# EAGLE design KW_LCD (EAGLE 7.7.0)
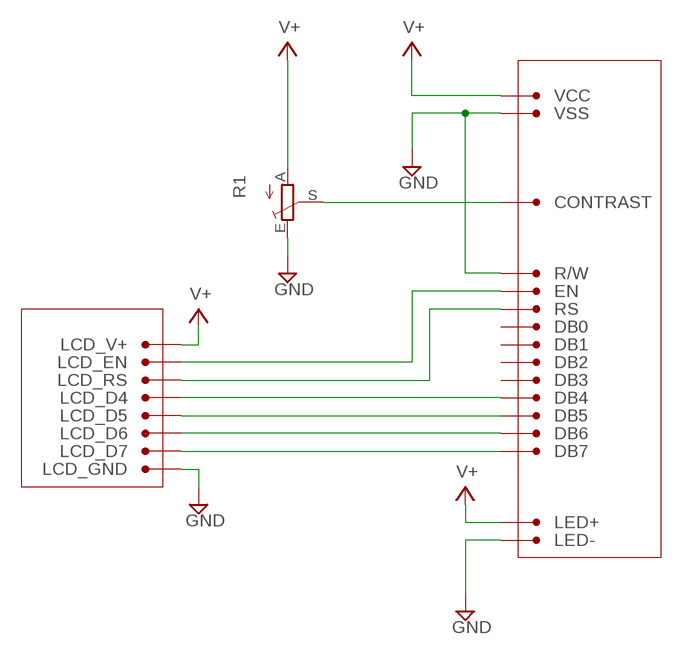
[diagram p0: schematic, sheet 1]

## Parts
CONTRAST  3  CONN  [CONN]
DB0  7  CONN  [CONN]
DB1  8  CONN  [CONN]
DB2  9  CONN  [CONN]
DB3  10  CONN  [CONN]
DB4  11  CONN  [CONN]
DB5  12  CONN  [CONN]
DB6  13  CONN  [CONN]
DB7  14  CONN  [CONN]
EN  6  CONN  [CONN]
LCD_D4  14  CONN  [CONN]
LCD_D5  14  CONN  [CONN]
LCD_D6  14  CONN  [CONN]
LCD_D7  14  CONN  [CONN]
LCD_EN  14  CONN  [CONN]
LCD_GND  14  CONN  [CONN]
LCD_RS  14  CONN  [CONN]
LCD_V+  14  CONN  [CONN]
LED+  16  CONN  [CONN]
LED-  15  CONN  [CONN]
R1  TRIM_EU-ECP10S  [ECP10S]
R/W  5  CONN  [CONN]
RS  4  CONN  [CONN]
VCC  2  CONN  [CONN]
VSS  1  CONN  [CONN]

## Nets
GND: LCD_GND.P$1 LED-.P$1 R1.E R/W.P$1 VSS.P$1
N$1: DB7.P$1 LCD_D7.P$1
N$2: DB6.P$1 LCD_D6.P$1
N$4: LCD_RS.P$1 RS.P$1
N$5: CONTRAST.P$1 R1.S
N$6: EN.P$1 LCD_EN.P$1
N$7: DB5.P$1 LCD_D5.P$1
N$8: DB4.P$1 LCD_D4.P$1
V+: LCD_V+.P$1 LED+.P$1 R1.A VCC.P$1
Unconnected: DB0.P$1 DB1.P$1 DB2.P$1 DB3.P$1

## Library data of the parts
CONTRAST DB0 DB1-DB7 EN LCD_D4-LCD_D7 LCD_EN LCD_GND LCD_RS LCD_V+ LED+ LED- R/W RS VCC VSS = Pin:CONN
R1 = pot:TRIM_EU-: POTENTIOMETER

## Board
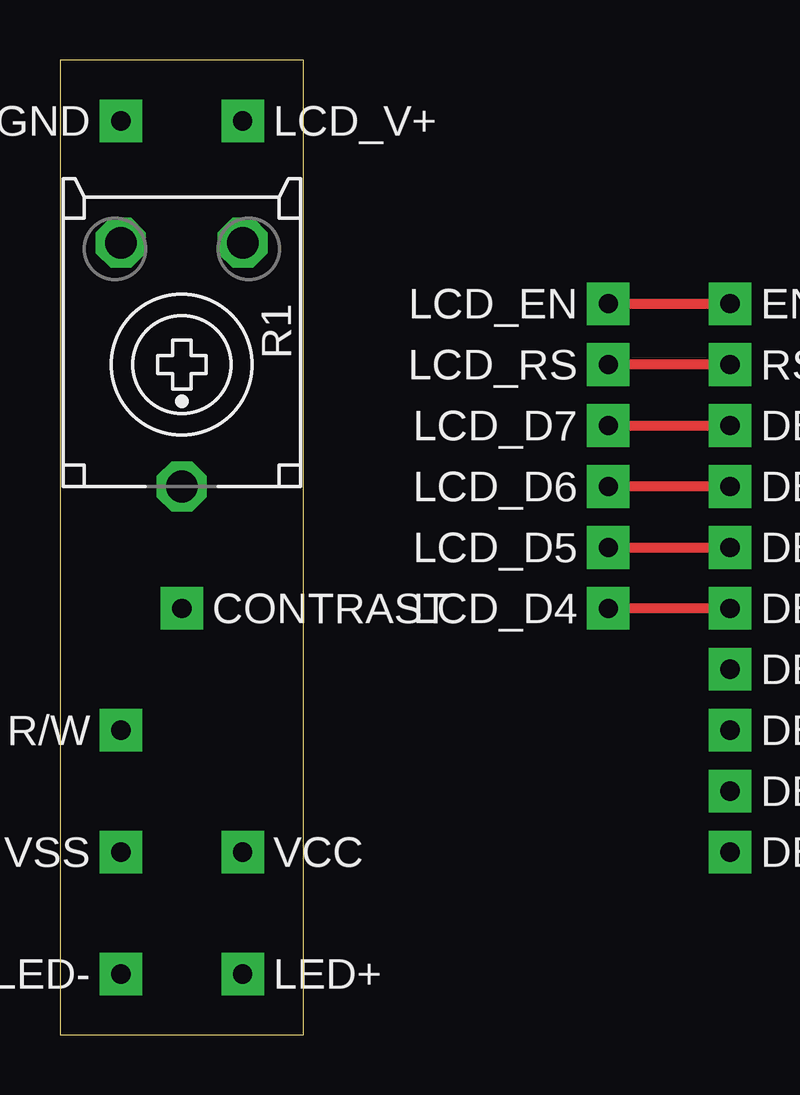
[diagram p1: board, top side]
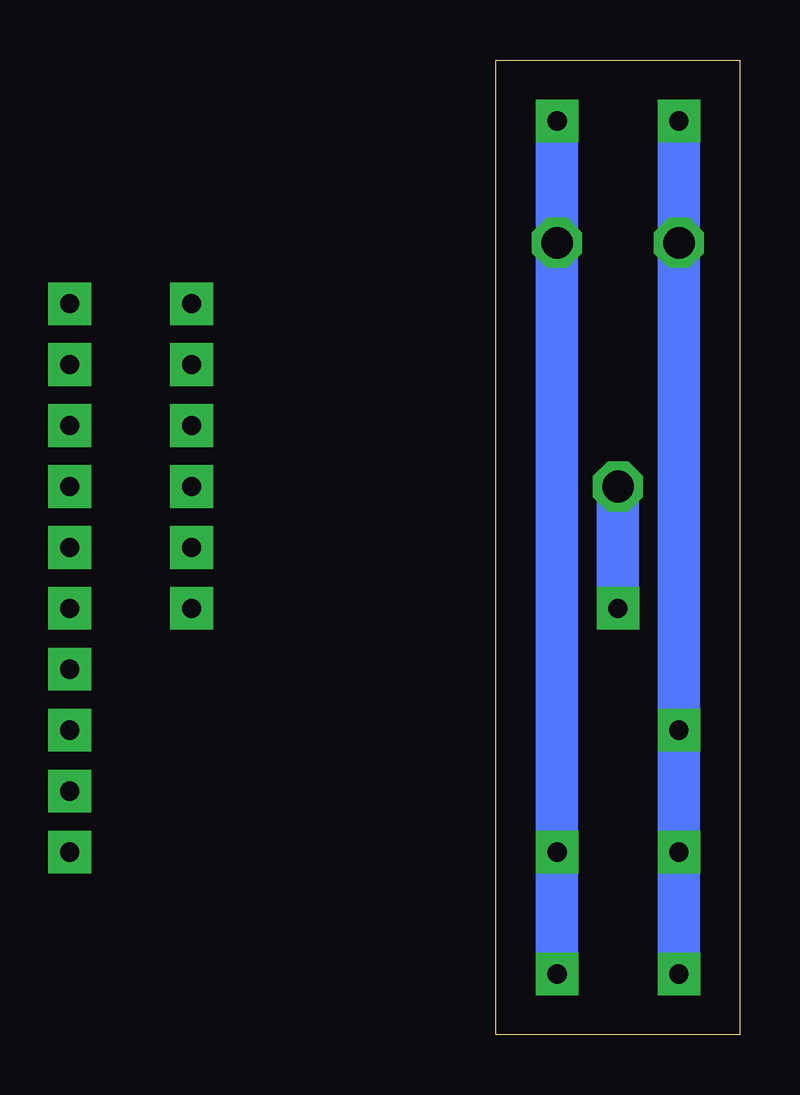
[diagram p2: board, bottom side, seen from below]

Size 10.16 x 40.64 mm. Coordinates in mm from the lower left corner, seen from the top.
Outline: 0,0 10.16,0 10.16,40.64 0,40.64 0,0
Copper layers (1*16): Top 0.035mm / dielectric 1.5mm / Bottom 0.035mm
Design rules "default": minimum track width 70mil, minimum drill 40mil, track to track 8mil, track to pad 8mil, pad to pad 8mil, via to via 8mil, smd to smd 8mil, copper to edge 40mil, drill to drill 8mil, minimum pad ring 10mil, minimum via ring 10mil, stop-mask expansion 4mil, vias tented up to drill 0mil, thermal gap 10mil

### Footprints (pad centres in the part's own frame; a part is rotated, then mirrored left to right if it is on the bottom)
CONN = drill 0.8 pad 1.778 square: P$1 0,0
ECP10S = drill 1.321 octagon: A -2.54,-5.08; E 2.54,-5.08; S 0,5.08

### Placement (x,y rotation side)
CONTRAST  5.08,17.78 0 top
DB0  27.94,7.62 0 top  (outside the outline)
DB1  27.94,10.16 0 top  (outside the outline)
DB2  27.94,12.7 0 top  (outside the outline)
DB3  27.94,15.24 0 top  (outside the outline)
DB4  27.94,17.78 0 top  (outside the outline)
DB5  27.94,20.32 0 top  (outside the outline)
DB6  27.94,22.86 0 top  (outside the outline)
DB7  27.94,25.4 0 top  (outside the outline)
EN  27.94,30.48 0 top  (outside the outline)
LCD_D4  22.86,17.78 180 top  (outside the outline)
LCD_D5  22.86,20.32 180 top  (outside the outline)
LCD_D6  22.86,22.86 180 top  (outside the outline)
LCD_D7  22.86,25.4 180 top  (outside the outline)
LCD_EN  22.86,30.48 180 top  (outside the outline)
LCD_GND  2.54,38.1 180 top
LCD_RS  22.86,27.94 180 top  (outside the outline)
LCD_V+  7.62,38.1 0 top
LED+  7.62,2.54 0 top
LED-  2.54,2.54 180 top
R1  5.08,27.94 180 top
R/W  2.54,12.7 180 top
RS  27.94,27.94 0 top  (outside the outline)
VCC  7.62,7.62 0 top
VSS  2.54,7.62 180 top

### Tracks (layer width: path | path; a pad name or v marks a point on that pad's centre or on a via)
GND
  Bottom 1.778: LCD_GND.P$1 R1.E R/W.P$1 VSS.P$1 LED-.P$1
N$1
  Top 0.406: LCD_D7.P$1 DB7.P$1
N$2
  Top 0.406: DB6.P$1 LCD_D6.P$1
N$4
  Top 0.406: RS.P$1 LCD_RS.P$1
N$5
  Bottom 1.778: CONTRAST.P$1 R1.S
N$6
  Top 0.406: LCD_EN.P$1 EN.P$1
N$7
  Top 0.406: LCD_D5.P$1 DB5.P$1
N$8
  Top 0.406: DB4.P$1 LCD_D4.P$1
V+
  Bottom 1.778: LED+.P$1 VCC.P$1 R1.A LCD_V+.P$1